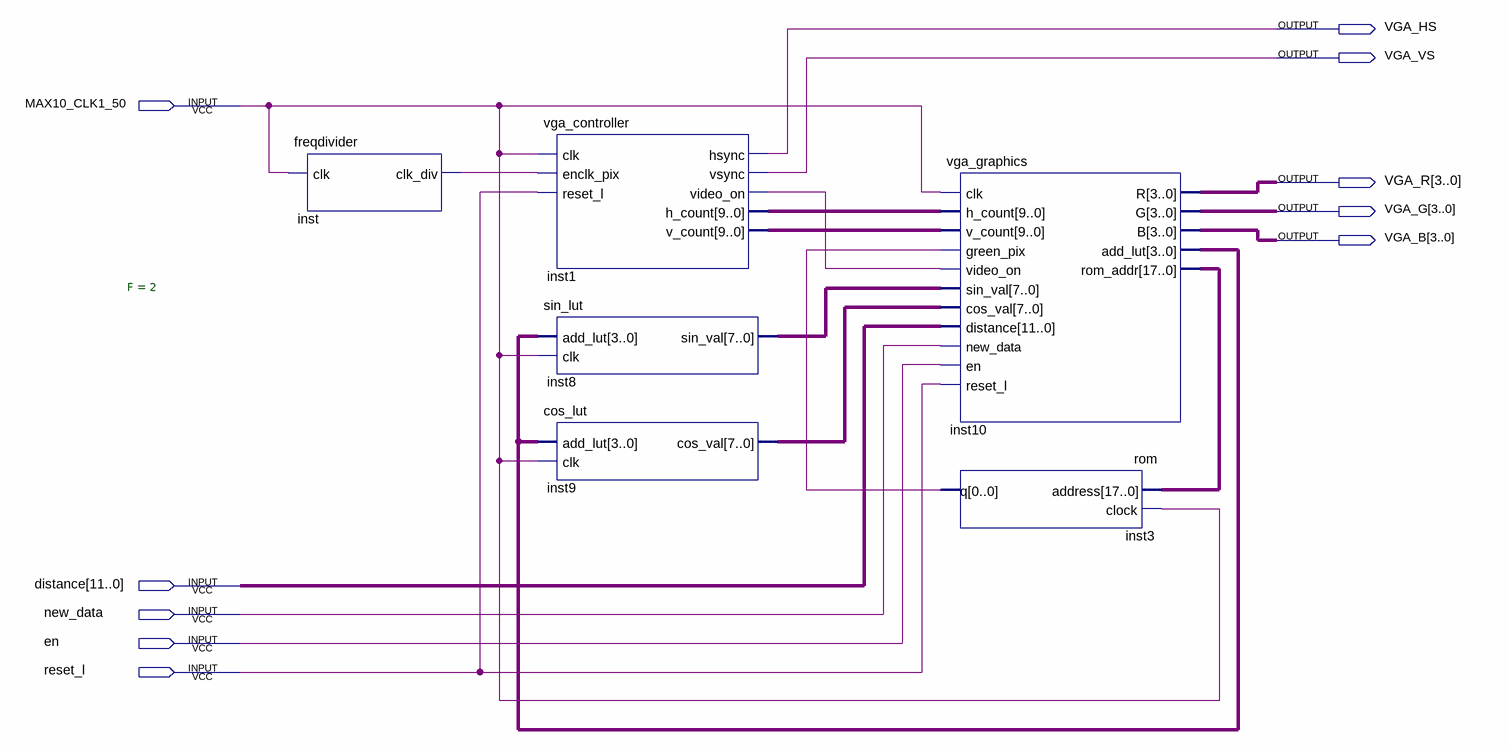
[diagram p0: schematic sheet]
// Quartus schematic vga.bdf as structural Verilog: 6 symbols, 10 pins
module vga (
  input  MAX10_CLK1_50,
  input  [11:0] distance,
  input  new_data,
  input  en,
  input  reset_l,
  output VGA_HS,
  output VGA_VS,
  output [3:0] VGA_R,
  output [3:0] VGA_G,
  output [3:0] VGA_B
);

  wire inst1_video_on, inst3_q, inst_clk_div;
  wire [3:0] inst10_add_lut;
  wire [7:0] inst8_sin_val, inst9_cos_val;
  wire [9:0] inst1_h_count, inst1_v_count;
  wire [17:0] inst10_rom_addr;

  freqdivider #(.F(2)) inst (.clk(MAX10_CLK1_50), .clk_div(inst_clk_div));
  vga_controller inst1 (
    .clk(MAX10_CLK1_50), .enclk_pix(inst_clk_div), .reset_l(reset_l), .hsync(VGA_HS), .vsync(VGA_VS),
    .video_on(inst1_video_on), .h_count(inst1_h_count), .v_count(inst1_v_count));
  sin_lut inst8 (.add_lut(inst10_add_lut), .clk(MAX10_CLK1_50), .sin_val(inst8_sin_val));
  cos_lut inst9 (.add_lut(inst10_add_lut), .clk(MAX10_CLK1_50), .cos_val(inst9_cos_val));
  vga_graphics inst10 (
    .clk(MAX10_CLK1_50), .h_count(inst1_h_count), .v_count(inst1_v_count), .green_pix(inst3_q),
    .video_on(inst1_video_on), .sin_val(inst8_sin_val), .cos_val(inst9_cos_val), .distance(distance),
    .new_data(new_data), .en(en), .reset_l(reset_l), .R(VGA_R), .G(VGA_G), .B(VGA_B),
    .add_lut(inst10_add_lut), .rom_addr(inst10_rom_addr));
  rom inst3 (.address(inst10_rom_addr), .clock(MAX10_CLK1_50), .q(inst3_q));
endmodule
